# Altium schematic sheet [07]-PowerSupply.SchDoc: Powersupplies (part 3 of 4)
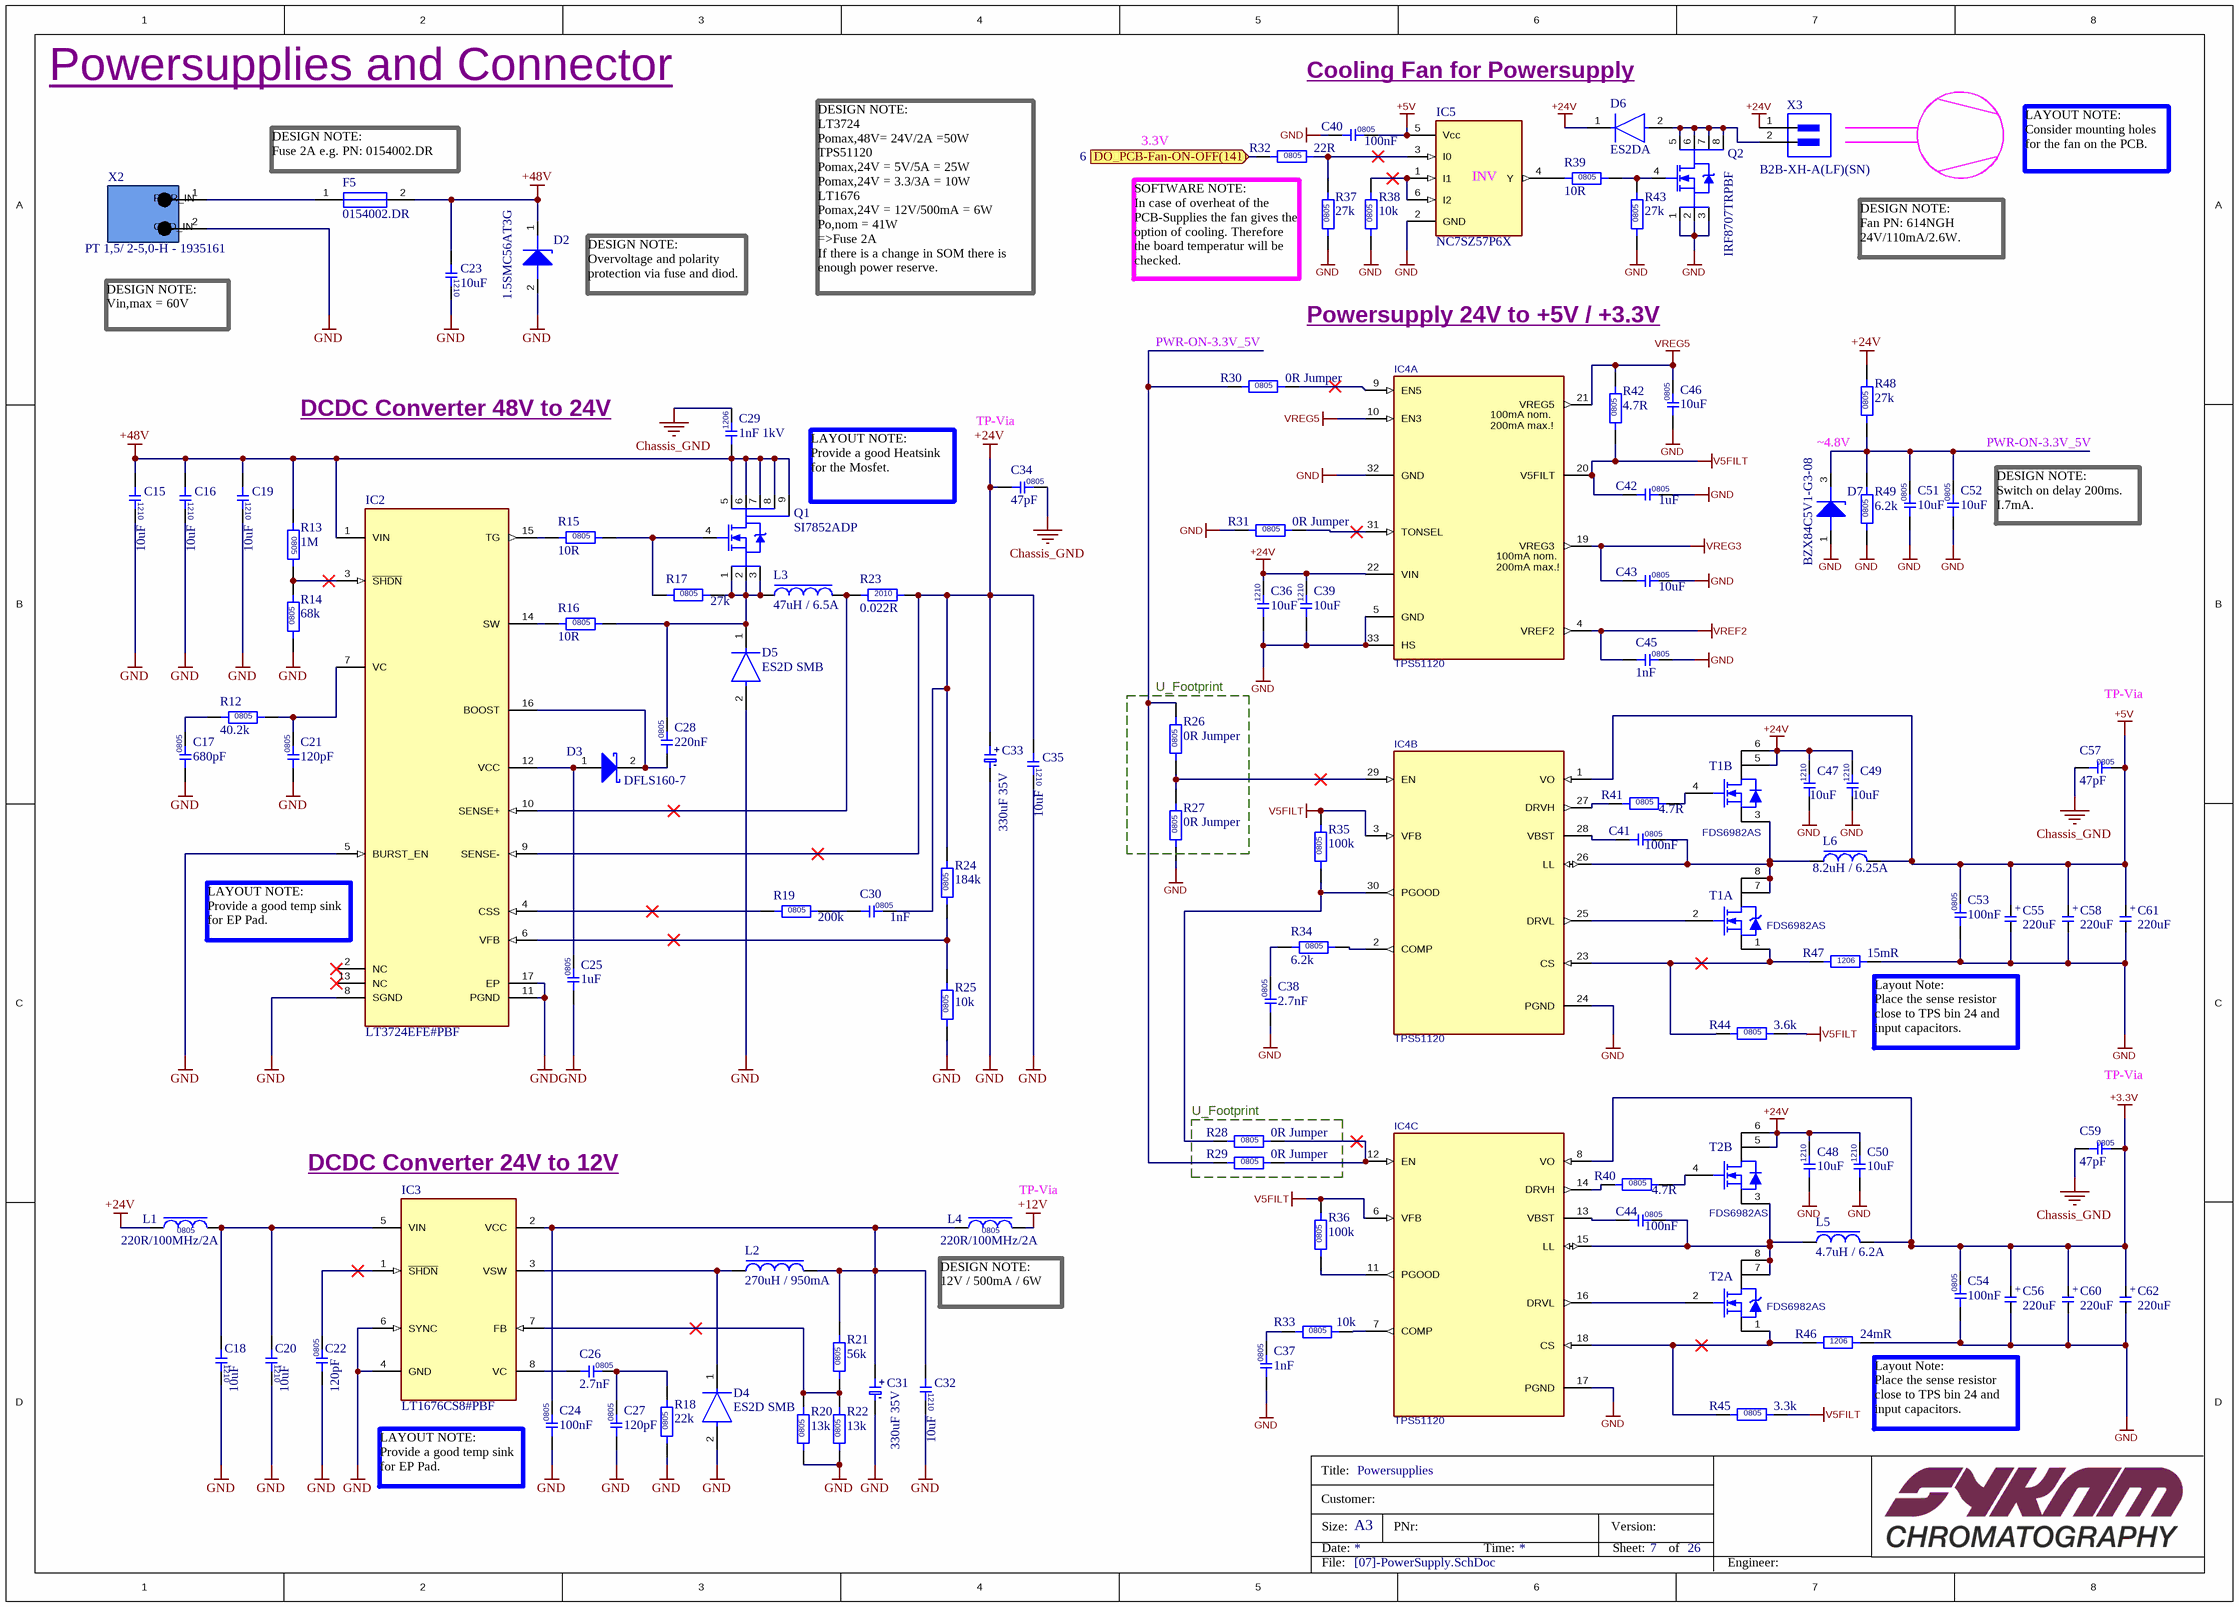
[diagram p2: [07]-PowerSupply.SchDoc]

## Library data of the parts (continued)
L1 L4 = L_BLM21PG221SN1D: Ferrite Beads Multi-Layer 220Ohm 25% 100MHz 2A 45mOhm DCR 0805 Paper T/R; Manufacturer: Murata; Material: Ferrite,Steel; Shielding: Unshielded; Number of Circuits: 1; DC Resistance (DCR): 45mR; Impedance: 220R; PCBChecked: initials after Checked; Supplier 1: Digi-Key; Manufacturer Part Number: BLM21PG221SN1D; RoHS: Yes; Category: Ferrite Beads and Chips; Case/Package: 0805; Number of Pins: 2; Case Code (Imperial): 0805; Core Material: Ferrite; Contact Plating: Tin,Matte; Case Code (Metric): 2012; Min Operating Temperature: -55°C; Max Operating Temperature: 125°C; Frequency: 100MHz; Number of Lines: 1; Max DC Current: 2A; Termination: SMD/SMT; Test Frequency: 100MHz; DC Current: 2A; Military Standard: Not; Current: 2A; Package Quantity: 1; Tolerance: 25%; Max Current Rating: 2A; Packaging: Tape and Reel; Current Rating: 2A; Length: 2mm; Height: 0.85mm; Depth: 1.25mm; Width: 1.25mm; Radiation Hardening: No; Lead Free: Lead Free; REACH SVHC: No SVHC; ComponentLink1URL: https://datasheet.ciiva.com/1012/l0110s0100blm21p-1012288.pdf?src-supplier=Digi-Key; ComponentLink1Description: https://datasheet.ciiva.com/1012/l0110s0100blm21p-1012288.pdf?src-supplier=Digi-Key; ComponentLink2URL: https://datasheet.ciiva.com/11799/0900766b81275e31-11799232.pdf?src-supplier=RSComponents; ComponentLink2Description: https://datasheet.ciiva.com/11799/0900766b81275e31-11799232.pdf?src-supplier=RSComponents; ComponentLink3URL: https://datasheet.ciiva.com/30514/1845321-30514028.pdf?src-supplier=Jameco; ComponentLink3Description: https://datasheet.ciiva.com/30514/1845321-30514028.pdf?src-supplier=Jameco; ComponentLink4URL: https://datasheet.ciiva.com/29348/442529-da-01-en-chip-drossel-0805-220r-2000ma-2-0x1-25mm-29348007.pdf?src-supplier=Conrad; ComponentLink4Description: https://datasheet.ciiva.com/29348/442529-da-01-en-chip-drossel-0805-220r-2000ma-2-0x1-25mm-29348007.pdf?src-supplier=Conrad; ComponentLink5URL: https://datasheet.ciiva.com/1012/l0110s0100blm21p-1012289.pdf?src-supplier=Digi-Key; ComponentLink5Description: https://datasheet.ciiva.com/1012/l0110s0100blm21p-1012289.pdf?src-supplier=Digi-Key; ComponentLink6URL: https://datasheet.ciiva.com/16215/l0110s0100blm21p-16215194.pdf?src-supplier=Future+Electronics; ComponentLink6Description: https://datasheet.ciiva.com/16215/l0110s0100blm21p-16215194.pdf?src-supplier=Future+Electronics; ComponentLink7URL: https://datasheet.ciiva.com/8021/1756152-8021598.pdf?src-supplier=Element14; ComponentLink7Description: https://datasheet.ciiva.com/8021/1756152-8021598.pdf?src-supplier=Element14; ComponentLink8URL: https://datasheet.ciiva.com/14122/anblm21p-data-e-14122214.pdf?src-supplier=Distrelec; ComponentLink8Description: https://datasheet.ciiva.com/14122/anblm21p-data-e-14122214.pdf?src-supplier=Distrelec; ComponentLink9URL: https://datasheet.ciiva.com/3081/l0110s0100blm21p-3081655.pdf?src-supplier=Avnet; ComponentLink9Description: https://datasheet.ciiva.com/3081/l0110s0100blm21p-3081655.pdf?src-supplier=Avnet; ComponentLink10URL: https://datasheet.ciiva.com/8021/1756152-8021596.pdf?src-supplier=Element14; ComponentLink10Description: https://datasheet.ciiva.com/8021/1756152-8021596.pdf?src-supplier=Element14; Supplier Part Number 1: 490-1054-6-ND; Stock 1: 868092; IPC7352C: done; SCHChecked: Initials after checked
L2 = L_270uH_SRR1208-271KL: Inductor Power Shielded Wirewound 270uH 10% 1KHz 13Q-Factor Ferrite 950mA 400mOhm DCR T/R; Manufacturer: Bourns; Saturation Current: 1.25A; DC Resistance (DCR): 400mR; Q Factor: 13; Self Resonant Frequency: 2MHz; Supplier 1: Farnell; Manufacturer Part Number: SRR1208-271KL; RoHS: Yes; Category: Fixed Inductors; Stock 1: 3; Pricing 1: 1=0,27700 (EUR); Mount: Surface Mount; Case/Package: 1208; Number of Pins: 2; Core Material: Ferrite; Min Operating Temperature: -40°C; Max Operating Temperature: 125°C; Package Quantity: 400; Current Rating: 950mA; Resistor Type: Wirewound; Inductance: 270uH; Test Frequency: 1kHz; Max DC Current: 950mA; Termination: SMD/SMT; RMS Current (Irms): 950mA; DC Current: 950mA; Inductance Tolerance: 10%; Tolerance: 10%; Packaging: Tape and Reel; Shielding: Shielded; Length: 0.5inch; Width: 0.5inch; Height: 8.5mm; Height - Seated (Max): 0.335inch; Depth: 13mm; REACH SVHC: No SVHC; Military Standard: Not; ComponentLink1URL: https://datasheet.ciiva.com/15025/srr1208-15025095.pdf?src-supplier=Digi-Key; ComponentLink1Description: https://datasheet.ciiva.com/15025/srr1208-15025095.pdf?src-supplier=Digi-Key; ComponentLink2URL: https://datasheet.ciiva.com/15025/srr1208-15025096.pdf?src-supplier=Digi-Key; ComponentLink2Description: https://datasheet.ciiva.com/15025/srr1208-15025096.pdf?src-supplier=Digi-Key; ComponentLink3URL: https://datasheet.ciiva.com/22717/1483756-22717964.pdf?src-supplier=Element14; ComponentLink3Description: https://datasheet.ciiva.com/22717/1483756-22717964.pdf?src-supplier=Element14; ComponentLink4URL: https://datasheet.ciiva.com/48684/srr1208-48684550.pdf?src-supplier=Avnet; ComponentLink4Description: https://datasheet.ciiva.com/48684/srr1208-48684550.pdf?src-supplier=Avnet; ComponentLink5URL: https://datasheet.ciiva.com/1072/srr1208-1072506.pdf?src-supplier=Digi-Key; ComponentLink5Description: https://datasheet.ciiva.com/1072/srr1208-1072506.pdf?src-supplier=Digi-Key; Supplier Part Number 1: 2333699
L3 = L_47uH_SRP1265A-470M: FIXED IND 47UH 6.5A 90 MOHM SMD; Manufacturer: Bourns; Core Material: Ferrite,Carbonyl Powder; Saturation Current: 9.5A; Shielding: Shielded; DC Resistance (DCR): 90mR; Self Resonant Frequency: 4MHz; Test Frequency: 100kHz; Tolerance: 20%; Q Factor: 20; Supplier 1: Farnell; Manufacturer Part Number: SRP1265A-470M; RoHS: Yes; Category: Fixed Inductors; Stock 1: 517; Pricing 1: 1=1,70000, 10=1,24000, 50=1,05000, 100=0,94300, 200=0,81000, 500=0,79900, 2500=0,76500 (EUR); Mount: Surface Mount; Case/Package: Nonstandard; Min Operating Temperature: -40°C; Max Operating Temperature: 150°C; Resistor Type: Wirewound; Inductance: 47uH; Current Rating: 6.5A; RMS Current (Irms): 6.5A; Max DC Current: 6.5A; Termination: SMD/SMT; Packaging: Tape and Reel; Inductance Tolerance: 20%; Package Quantity: 500; Length: 13.5mm; Width: 12.5mm; Height: 6.2mm; Height - Seated (Max): 0.252inch; Depth: 12.5mm; Ratings: AEC-Q200; REACH SVHC: No SVHC; ComponentLink1URL: https://datasheet.ciiva.com/48684/srp1265a-48684885.pdf?src-supplier=Avnet; ComponentLink1Description: https://datasheet.ciiva.com/48684/srp1265a-48684885.pdf?src-supplier=Avnet; ComponentLink2URL: https://datasheet.ciiva.com/46437/1828825-46437462.pdf?src-supplier=Element14; ComponentLink2Description: https://datasheet.ciiva.com/46437/1828825-46437462.pdf?src-supplier=Element14; Supplier Part Number 1: 2434080
L5 = L_7447797470: WURTH ELEKTRONIK - 7447797470 - Power Inductor (SMD), 4.7 µH, 6.2 A, Shielded, 8 A, WE-PDF Series, 10.2mm x 10.2mm x 4.5mm - Power Inductor (SMD), 4.7 µH, 6.2 A, Shielded, 8 A, WE-PDF Series, 10.2mm x 10.2mm x 4.5mm; Manufacturer: Wurth Electronics; Core Material: Metal,Composite,Ferrite; Tolerance: 20%; Self Resonant Frequency: 45MHz; Saturation Current: 8A; DC Resistance (DCR): 19.5mR; Test Frequency: 100kHz; Max DC Current: 5.8A; Supplier 1: Farnell; Manufacturer Part Number: 7447797470; RoHS: Yes; Category: Fixed Inductors; Stock 1: 245; Pricing 1: 1=3,18000, 5=2,76000, 10=2,33000, 20=2,29000, 40=2,25000, 100=1,93000, 500=1,69000 (EUR); Mount: Surface Mount; Case/Package: Nonstandard; Min Operating Temperature: -40°C; Max Operating Temperature: 150°C; Inductance: 4.7uH; Inductance Tolerance: 20%; Package Quantity: 500; Current Rating: 6.2A; Shielding: Shielded; Packaging: Cut Tape; Resistor Type: Wirewound; RMS Current (Irms): 6.2A; Length: 0.402inch; Height: 4.5mm; Width: 0.402inch; Height - Seated (Max): 0.177inch; Depth: 10.2mm; REACH SVHC: Unknown; Lead Free: Lead Free; ComponentLink1URL: https://datasheet.ciiva.com/11803/0900766b80d8967e-11803072.pdf?src-supplier=RSComponents; ComponentLink1Description: https://datasheet.ciiva.com/11803/0900766b80d8967e-11803072.pdf?src-supplier=RSComponents; ComponentLink2URL: https://datasheet.ciiva.com/1059/7447797470-1059286.pdf?src-supplier=Digi-Key; ComponentLink2Description: https://datasheet.ciiva.com/1059/7447797470-1059286.pdf?src-supplier=Digi-Key; ComponentLink3URL: https://datasheet.ciiva.com/5975/530533-5975593.pdf?src-supplier=Farnell; ComponentLink3Description: https://datasheet.ciiva.com/5975/530533-5975593.pdf?src-supplier=Farnell; ComponentLink4URL: https://datasheet.ciiva.com/1059/7447797470-1059287.pdf?src-supplier=Digi-Key; ComponentLink4Description: https://datasheet.ciiva.com/1059/7447797470-1059287.pdf?src-supplier=Digi-Key; ComponentLink5URL: https://datasheet.ciiva.com/1059/7447797470-1059288.pdf?src-supplier=Digi-Key; ComponentLink5Description: https://datasheet.ciiva.com/1059/7447797470-1059288.pdf?src-supplier=Digi-Key; Supplier Part Number 1: 1800270
L6 = L_744771008: Inductor, SMD 8.2 uH 6.25 A ±20%, 744771008, Würth Elektronik; Manufacturer: Wurth Electronics; Core Material: Ferrite; Shielding: Shielded; Self Resonant Frequency: 25MHz; Resistance: 20mR; Test Frequency: 1kHz; Supplier 1: Farnell; Manufacturer Part Number: 744771008; RoHS: Yes; Category: Fixed Inductors; Stock 1: 675; Pricing 1: 1=2,49000, 5=2,20000, 10=1,90000, 20=1,73000, 40=1,55000, 100=1,27000, 500=1,10000 (EUR); Mount: Surface Mount; Case/Package: Nonstandard; Weight: 0.01lb; Min Operating Temperature: -40°C; Max Operating Temperature: 125°C; Package Quantity: 500; Current Rating: 6.25A; Saturation Current: 6.25A; Tolerance: 20%; Packaging: Tape and Reel; Inductance Tolerance: 20%; Inductance: 8.2uH; Resistor Type: Wirewound; DC Resistance (DCR): 20mR; Max DC Current: 6.25A; Termination: SMD/SMT; RMS Current (Irms): 6.25A; Series Resistance: 20mR; Length: 12mm; Height: 6mm; Width: 12mm; Height - Seated (Max): 0.236inch; Depth: 12mm; REACH SVHC: Unknown; Lead Free: Lead Free; ComponentLink1URL: https://datasheet.ciiva.com/1052/744771008-1052275.pdf?src-supplier=Digi-Key; ComponentLink1Description: https://datasheet.ciiva.com/1052/744771008-1052275.pdf?src-supplier=Digi-Key; ComponentLink2URL: https://datasheet.ciiva.com/4954/744771008-28897-4954803.pdf?src-supplier=Mouser; ComponentLink2Description: https://datasheet.ciiva.com/4954/744771008-28897-4954803.pdf?src-supplier=Mouser; ComponentLink3URL: https://datasheet.ciiva.com/30489/0900766b81281ba3-30489743.pdf?src-supplier=RSComponents; ComponentLink3Description: https://datasheet.ciiva.com/30489/0900766b81281ba3-30489743.pdf?src-supplier=RSComponents; ComponentLink4URL: https://datasheet.ciiva.com/1052/744771008-1052276.pdf?src-supplier=Digi-Key; ComponentLink4Description: https://datasheet.ciiva.com/1052/744771008-1052276.pdf?src-supplier=Digi-Key; ComponentLink5URL: https://datasheet.ciiva.com/1052/744771008-1052277.pdf?src-supplier=Digi-Key; ComponentLink5Description: https://datasheet.ciiva.com/1052/744771008-1052277.pdf?src-supplier=Digi-Key; ComponentLink6URL: https://datasheet.ciiva.com/26307/744771008-eng-tds-26307964.pdf?src-supplier=Distrelec; ComponentLink6Description: https://datasheet.ciiva.com/26307/744771008-eng-tds-26307964.pdf?src-supplier=Distrelec; Supplier Part Number 1: 1635905
Q1 = Q_NMOS_SI7852ADP-T1-GE3: MOSFET N-CH 80V 30A PPAK SO-8; Manufacturer: Vishay Siliconix; Rise Time: 9ns; Rds On Max: 17mR; Input Capacitance: 1.825nF; Continuous Drain Current (ID): 12A; Max Power Dissipation: 62.5W; Gate to Source Voltage (Vgs): 20V; Turn-Off Delay Time: 26ns; Turn-On Delay Time: 16ns; Element Configuration: Single; Number of Channels: 1; Polarity: N-CHANNEL; Threshold Voltage: 4.5V; Power Dissipation: 5W; Supplier 1: Mouser; Manufacturer Part Number: SI7852ADP-T1-GE3; RoHS: Yes; Category: MOSFETs; Stock 1: 3670; Mount: Surface Mount; Case/Package: SOIC; Number of Pins: 8; Weight: 0.01787oz; Min Operating Temperature: -55°C; Max Operating Temperature: 150°C; Packaging: Tape and Reel; Package Quantity: 1; Drain to Source Voltage (Vdss): 80V; Drain to Source Resistance: 17mR; Fall Time: 9ns; Drain to Source Breakdown Voltage: 80V; Number of Elements: 1; On-State Resistance: 17MR; Series: TrenchFET®; Drain-source On Resistance-Max: 17MR; Length: 4.9mm; Width: 5.89mm; Height: 1.04mm; Radiation Hardening: No; RoHS Compliant: Yes; REACH SVHC: Unknown; Lead Free: Lead Free; ComponentLink1URL: https://datasheet.ciiva.com/6386/si7852ad-6386432.pdf?src-supplier=Digi-Key; ComponentLink1Description: https://datasheet.ciiva.com/6386/si7852ad-6386432.pdf?src-supplier=Digi-Key; ComponentLink2URL: https://datasheet.ciiva.com/26791/si7852adp-t1-ge3-26791882.pdf?src-supplier=IIIC; ComponentLink2Description: https://datasheet.ciiva.com/26791/si7852adp-t1-ge3-26791882.pdf?src-supplier=IIIC; ComponentLink3URL: https://datasheet.ciiva.com/16486/si7852ad-16486555.pdf?src-supplier=Future+Electronics; ComponentLink3Description: https://datasheet.ciiva.com/16486/si7852ad-16486555.pdf?src-supplier=Future+Electronics; ComponentLink4URL: https://datasheet.ciiva.com/6386/si7852ad-6386428.pdf?src-supplier=Digi-Key; ComponentLink4Description: https://datasheet.ciiva.com/6386/si7852ad-6386428.pdf?src-supplier=Digi-Key; ComponentLink5URL: https://datasheet.ciiva.com/6386/si7852ad-6386431.pdf?src-supplier=Digi-Key; ComponentLink5Description: https://datasheet.ciiva.com/6386/si7852ad-6386431.pdf?src-supplier=Digi-Key; Supplier Part Number 1: 781-SI7852ADP-T1-GE3
Q2 = Q_IRF8707TRPBF: MOSFET N-CH 30V 11A 8-SOIC; Manufacturer: International Rectifier; Gate to Source Voltage (Vgs): 20V; Turn-On Delay Time: 6.7ns; Turn-Off Delay Time: 7.3ns; Fall Time: 4.4ns; Rise Time: 7.9ns; On-State Resistance: 11.9MR; Max Power Dissipation: 2.5W; Drain to Source Resistance: 17.5mR; Threshold Voltage: 1.8V; Number of Elements: 1; Input Capacitance: 760pF; Supplier 1: Farnell; Manufacturer Part Number: IRF8707TRPBF; RoHS: Yes; Category: MOSFETs; Stock 1: 1365; Pricing 1: 5=0,48600, 10=0,36900, 100=0,21900, 250=0,20900, 500=0,19800, 1000=0,16000, 5000=0,15700 (EUR); Mount: Surface Mount; Case/Package: SOIC; Number of Pins: 8; Min Operating Temperature: -55°C; Max Operating Temperature: 150°C; Drain to Source Voltage (Vdss): 30V; Continuous Drain Current (ID): 11A; Drain to Source Breakdown Voltage: 30V; Power Dissipation: 2.5W; Packaging: Tape and Reel; Package Quantity: 1; Rds On Max: 11.9mR; Nominal Vgs: 1.8V; Length: 5mm; Height: 1.5mm; Width: 4mm; Radiation Hardening: No; Lead Free: Lead Free; REACH SVHC: No SVHC; ComponentLink1URL: https://datasheet.ciiva.com/6382/irf8707pbf-6382832.pdf?src-supplier=Digi-Key; ComponentLink1Description: https://datasheet.ciiva.com/6382/irf8707pbf-6382832.pdf?src-supplier=Digi-Key; ComponentLink2URL: https://datasheet.ciiva.com/26790/irf8707trpbf-26790830.pdf?src-supplier=IIIC; ComponentLink2Description: https://datasheet.ciiva.com/26790/irf8707trpbf-26790830.pdf?src-supplier=IIIC; ComponentLink3URL: https://datasheet.ciiva.com/7870/28224-7870519.pdf?src-supplier=Element14; ComponentLink3Description: https://datasheet.ciiva.com/7870/28224-7870519.pdf?src-supplier=Element14; ComponentLink4URL: https://datasheet.ciiva.com/8116/irf8707pbf-8116344.pdf?src-supplier=Avnet; ComponentLink4Description: https://datasheet.ciiva.com/8116/irf8707pbf-8116344.pdf?src-supplier=Avnet; ComponentLink5URL: https://datasheet.ciiva.com/16369/irf8707pbf-16369518.pdf?src-supplier=Future+Electronics; ComponentLink5Description: https://datasheet.ciiva.com/16369/irf8707pbf-16369518.pdf?src-supplier=Future+Electronics; ComponentLink6URL: https://datasheet.ciiva.com/6382/irf8707pbf-6382827.pdf?src-supplier=Digi-Key; ComponentLink6Description: https://datasheet.ciiva.com/6382/irf8707pbf-6382827.pdf?src-supplier=Digi-Key; ComponentLink7URL: https://datasheet.ciiva.com/6382/irf8707pbf-6382830.pdf?src-supplier=Digi-Key; ComponentLink7Description: https://datasheet.ciiva.com/6382/irf8707pbf-6382830.pdf?src-supplier=Digi-Key; Supplier Part Number 1: 2725922
R12 = R_40.2k_CR0805-FX-4022ELF: Resistor,Ruthenium Oxide,40.2KOhms,100WV,1+/-% Tol,-100,100ppm-TC,0805-Case ;RoHS Compliant: Yes; Manufacturer: Bourns; Resistance: 40.2kR; Tolerance: 1%; Temperature Coefficient: 100ppm/°C; Power Rating: 125mW; Voltage Rating: 150V; Supplier 1: Mouser; Manufacturer Part Number: CR0805-FX-4022ELF; RoHS: Yes; Category: Chip SMD Resistors; Stock 1: 40102; Mount: Surface Mount; Case/Package: 0805; Contact Plating: Tin; Case Code (Imperial): 0805; Case Code (Metric): 2012; Min Operating Temperature: -55°C; Max Operating Temperature: 155°C; Resistor Type: Thick Film; Packaging: Tape and Reel; Package Quantity: 5000; Termination: SMD/SMT; Number of Terminations: 2; Max Power Dissipation: 125mW; Features: Moisture Resistant; Length: 2mm; Width: 1.25mm; Height: 0.024inch; Depth: 1.25mm; Thickness: 508um; Radiation Hardening: No; Military Standard: Not; ComponentLink1URL: https://datasheet.ciiva.com/9121/chpreztr-9121414.pdf?src-supplier=Avnet; ComponentLink1Description: https://datasheet.ciiva.com/9121/chpreztr-9121414.pdf?src-supplier=Avnet; ComponentLink2URL: https://datasheet.ciiva.com/14985/chpreztr-14985769.pdf?src-supplier=Digi-Key; ComponentLink2Description: https://datasheet.ciiva.com/14985/chpreztr-14985769.pdf?src-supplier=Digi-Key; Supplier Part Number 1: 652-CR0805FX-4022ELF
R13 = R_1M_RC0805FR-071ML: Res Thick Film 0805 1M Ohm 1% 0.125W(1/8W) ±100ppm/C Epoxy SMD T/R; Manufacturer: Yageo; Temperature Coefficient: 100ppm/°C; Resistance: 1MR; Power Rating: 125mW; Voltage Rating: 150V; Manufacturer Part Number: RC0805FR-071ML; RoHS: Yes; Category: Chip SMD Resistors; Case/Package: 0805; Case Code (Metric): 2012; Case Code (Imperial): 0805; Min Operating Temperature: -55°C; Max Operating Temperature: 155°C; Composition: Thick Film; Tolerance: 1%; Packaging: Tape and Reel; Number of Terminations: 2; Termination: SMD/SMT; Military Standard: Not; Max Power Dissipation: 125mW; Features: Moisture Resistant; Package Quantity: 1; Length: 0.079inch; Height: 0.024inch; Width: 0.049inch; Depth: 1.25mm; REACH SVHC: Unknown; Lead Free: Lead Free; ComponentLink1URL: https://datasheet.ciiva.com/2519/pyu-r-int-thick-7-2519712.pdf?src-supplier=Digi-Key; ComponentLink1Description: https://datasheet.ciiva.com/2519/pyu-r-int-thick-7-2519712.pdf?src-supplier=Digi-Key; ComponentLink2URL: https://datasheet.ciiva.com/12666/rc0805-12666975.pdf?src-supplier=Mouser; ComponentLink2Description: https://datasheet.ciiva.com/12666/rc0805-12666975.pdf?src-supplier=Mouser; ComponentLink3URL: https://datasheet.ciiva.com/2519/pyu-r-int-thick-7-2519713.pdf?src-supplier=Digi-Key; ComponentLink3Description: https://datasheet.ciiva.com/2519/pyu-r-int-thick-7-2519713.pdf?src-supplier=Digi-Key; ComponentLink4URL: https://datasheet.ciiva.com/2519/pyu-r-int-thick-7-2519711.pdf?src-supplier=Digi-Key; ComponentLink4Description: https://datasheet.ciiva.com/2519/pyu-r-int-thick-7-2519711.pdf?src-supplier=Digi-Key; ComponentLink5URL: https://datasheet.ciiva.com/17419/rc0805-17419909.pdf?src-supplier=Future+Electronics; ComponentLink5Description: https://datasheet.ciiva.com/17419/rc0805-17419909.pdf?src-supplier=Future+Electronics; Stock 2: 3286221; Pricing 2: 1=0,10000, 10=0,04000, 100=0,01630, 1000=0,00731, 2500=0,00635 (USD); Mount: Surface Mount; Number of Pins: 2; Voltage Rating (DC): 150V; ComponentLink6URL: http://www.farnell.com/datasheets/2167052.pdf?src-supplier=Farnell; ComponentLink6Description: http://www.farnell.com/datasheets/2167052.pdf?src-supplier=Farnell; ComponentLink7URL: http://www.mouser.com/ds/2/447/Yageo_08112016_RC0805-968729.pdf?src-supplier=Mouser; ComponentLink7Description: http://www.mouser.com/ds/2/447/Yageo_08112016_RC0805-968729.pdf?src-supplier=Mouser; ComponentLink8URL: http://www.farnell.com/datasheets/444164.pdf?src-supplier=Element14; ComponentLink8Description: http://www.farnell.com/datasheets/444164.pdf?src-supplier=Element14; ComponentLink9URL: http://www.farnell.com/datasheets/2167052.pdf?src-supplier=Newark; ComponentLink9Description: http://www.farnell.com/datasheets/2167052.pdf?src-supplier=Newark; ComponentLink10URL: http://www.yageo.com/documents/recent/PYu-RC_Group_51_RoHS_L_10.pdf?src-supplier=Digi-Key; ComponentLink10Description: http://www.yageo.com/documents/recent/PYu-RC_Group_51_RoHS_L_10.pdf?src-supplier=Digi-Key; Supplier 1: Digi-Key; Supplier Part Number 1: 311-1.00MCRCT-ND
R14 = R_68k_CRCW080568K0FKEA: VISHAY - CRCW080568K0FKEA - SMD Chip Resistor, 0805 [2012 Metric], 68 kohm, CRCW e3 Series, 150 V, Thick Film, 125 mW; Resistance: 68kR; Tolerance: 1%; Temperature Coefficient: 100ppm/°C; Power Rating: 125mW; Voltage Rating: 150V; Supplier 1: Farnell; Manufacturer: Vishay; Manufacturer Part Number: CRCW080568K0FKEA; RoHS: Yes; Category: Chip SMD Resistors; Stock 1: 12029; Pricing 1: 10=0,06040, 100=0,02760, 500=0,01940, 1000=0,01110, 2500=0,01050 (EUR); Case/Package: 0805; Number of Pins: 2; Case Code (Imperial): 0805; Case Code (Metric): 2012; Contact Plating: Tin; Weight: 0.000194oz; Size Code: 0805; Min Operating Temperature: -55°C; Max Operating Temperature: 155°C; Packaging: Tape and Reel; Resistor Type: Thick Film; Termination: SMD/SMT; Series: CRCW; Package Quantity: 10; Max Power Dissipation: 125mW; Number of Terminations: 2; Voltage Rating (DC): 150V; Features: Automotive AEC-Q200; Construction: Rectangular; Resistance Tolerance: 1%; Technology: THICK FILM; Length: 2mm; Width: 1.25mm; Height: 0.45mm; Depth: 1.25mm; Radiation Hardening: No; RoHS Compliant: Yes; Lead Free: Lead Free; Military Standard: Not; REACH SVHC: Unknown; ComponentLink1URL: https://datasheet.ciiva.com/11809/0900766b80d98b26-11809168.pdf?src-supplier=RSComponents; ComponentLink1Description: https://datasheet.ciiva.com/11809/0900766b80d98b26-11809168.pdf?src-supplier=RSComponents; ComponentLink2URL: https://datasheet.ciiva.com/2495/dcrcwe3-2495650.pdf?src-supplier=Digi-Key; ComponentLink2Description: https://datasheet.ciiva.com/2495/dcrcwe3-2495650.pdf?src-supplier=Digi-Key; ComponentLink3URL: https://datasheet.ciiva.com/2495/dcrcwe3-2495651.pdf?src-supplier=Digi-Key; ComponentLink3Description: https://datasheet.ciiva.com/2495/dcrcwe3-2495651.pdf?src-supplier=Digi-Key; ComponentLink4URL: https://datasheet.ciiva.com/2495/dcrcwe3-2495652.pdf?src-supplier=Digi-Key; ComponentLink4Description: https://datasheet.ciiva.com/2495/dcrcwe3-2495652.pdf?src-supplier=Digi-Key; ComponentLink5URL: https://datasheet.ciiva.com/7673/1697337-7673014.pdf?src-supplier=Element14; ComponentLink5Description: https://datasheet.ciiva.com/7673/1697337-7673014.pdf?src-supplier=Element14; ComponentLink6URL: https://datasheet.ciiva.com/17175/dcrcwe3-17175158.pdf?src-supplier=Avnet+Europe; ComponentLink6Description: https://datasheet.ciiva.com/17175/dcrcwe3-17175158.pdf?src-supplier=Avnet+Europe; ComponentLink7URL: https://datasheet.ciiva.com/16759/70201119-16759687.pdf?src-supplier=Allied+Electronics; ComponentLink7Description: https://datasheet.ciiva.com/16759/70201119-16759687.pdf?src-supplier=Allied+Electronics; ComponentLink8URL: https://datasheet.ciiva.com/7673/1697337-7673160.pdf?src-supplier=Element14; ComponentLink8Description: https://datasheet.ciiva.com/7673/1697337-7673160.pdf?src-supplier=Element14; ComponentLink9URL: https://datasheet.ciiva.com/8897/dcrcwe3-8897081.pdf?src-supplier=Avnet; ComponentLink9Description: https://datasheet.ciiva.com/8897/dcrcwe3-8897081.pdf?src-supplier=Avnet; ComponentLink10URL: https://datasheet.ciiva.com/26314/fld-crcw-e3-data-en-26314588.pdf?src-supplier=Distrelec; ComponentLink10Description: https://datasheet.ciiva.com/26314/fld-crcw-e3-data-en-26314588.pdf?src-supplier=Distrelec; Supplier Part Number 1: 1469953
R15 R16 R39 = R_10R_RC0805FR-0710RL: YAGEO (PHYCOMP) - RC0805FR-0710RL - RES, THICK FILM, 10R, 1%, 0.125W, 0805; Power Rating: 125mW; Voltage Rating: 150V; Temperature Coefficient: 200ppm/°C; PCBChecked: initials after Checked; Supplier 1: Digi-Key; Manufacturer Part Number: RC0805FR-0710RL; RoHS: Yes; Category: Chip SMD Resistors; Case/Package: 0805; Number of Pins: 2; Case Code (Imperial): 0805; Case Code (Metric): 2012; Min Operating Temperature: -55°C; Max Operating Temperature: 155°C; Resistance: 10R; Tolerance: 1%; Packaging: Tape and Reel; Voltage Rating (DC): 150V; Package Quantity: 1; Features: Moisture Resistant; Termination: SMD/SMT; Composition: Thick Film; Number of Terminations: 2; Max Power Dissipation: 125mW; Length: 2mm; Height: 0.5mm; Width: 1.25mm; Depth: 1.25mm; Lead Free: Lead Free; REACH SVHC: No SVHC; ComponentLink1URL: https://datasheet.ciiva.com/11809/0900766b8106beab-11809370.pdf?src-supplier=RSComponents; ComponentLink1Description: https://datasheet.ciiva.com/11809/0900766b8106beab-11809370.pdf?src-supplier=RSComponents; ComponentLink2URL: https://datasheet.ciiva.com/7941/444164-7941687.pdf?src-supplier=Element14; ComponentLink2Description: https://datasheet.ciiva.com/7941/444164-7941687.pdf?src-supplier=Element14; ComponentLink3URL: https://datasheet.ciiva.com/7941/444164-7941688.pdf?src-supplier=Element14; ComponentLink3Description: https://datasheet.ciiva.com/7941/444164-7941688.pdf?src-supplier=Element14; ComponentLink4URL: https://datasheet.ciiva.com/12555/rc0805-257173-12555112.pdf?src-supplier=Mouser; ComponentLink4Description: https://datasheet.ciiva.com/12555/rc0805-257173-12555112.pdf?src-supplier=Mouser; ComponentLink5URL: https://datasheet.ciiva.com/2457/pyu-r-int-thick-7-2457098.pdf?src-supplier=Digi-Key; ComponentLink5Description: https://datasheet.ciiva.com/2457/pyu-r-int-thick-7-2457098.pdf?src-supplier=Digi-Key; ComponentLink6URL: https://datasheet.ciiva.com/2457/pyu-r-int-thick-7-2457099.pdf?src-supplier=Digi-Key; ComponentLink6Description: https://datasheet.ciiva.com/2457/pyu-r-int-thick-7-2457099.pdf?src-supplier=Digi-Key; ComponentLink7URL: https://datasheet.ciiva.com/46412/444164-46412859.pdf?src-supplier=Element14; ComponentLink7Description: https://datasheet.ciiva.com/46412/444164-46412859.pdf?src-supplier=Element14; ComponentLink8URL: https://datasheet.ciiva.com/2457/pyu-r-int-thick-7-2457100.pdf?src-supplier=Digi-Key; ComponentLink8Description: https://datasheet.ciiva.com/2457/pyu-r-int-thick-7-2457100.pdf?src-supplier=Digi-Key; ComponentLink9URL: https://datasheet.ciiva.com/46447/444164-46447565.pdf?src-supplier=Element14; ComponentLink9Description: https://datasheet.ciiva.com/46447/444164-46447565.pdf?src-supplier=Element14; Supplier Part Number 1: 311-10.0CRCT-ND; Manufacturer: Yageo; Stock 1: 2009396; IPC7352C: done; SCHChecked: Initials after checked
R17 R37 R43 R48 = R_27k_RC0805FR-0727KL: Surface Mount Thick Film Resistor, RC Series, 27 kohm, 125 mW, - 1%, 150 V, 0805 [2012 Metric]; Manufacturer: Yageo; Resistance: 27kR; Temperature Coefficient: 100ppm/°C; Power Rating: 125mW; Voltage Rating: 150V; Supplier 1: Digi-Key; Manufacturer Part Number: RC0805FR-0727KL; RoHS: Yes; Category: Chip SMD Resistors; Stock 1: 307907; Pricing 1: 1=0,10000, 10=0,04000, 100=0,01630, 1000=0,00731, 2500=0,00635 (USD); Case/Package: 0805; Case Code (Metric): 2012; Case Code (Imperial): 0805; Min Operating Temperature: -55°C; Max Operating Temperature: 155°C; Tolerance: 1%; Composition: Thick Film; Packaging: Tape and Reel; Package Quantity: 1; Number of Terminations: 2; Termination: SMD/SMT; Military Standard: Not; Max Power Dissipation: 125mW; Features: Moisture Resistant; Length: 2mm; Height: 0.5mm; Width: 0.049inch; Depth: 1.25mm; Lead Free: Lead Free; REACH SVHC: Unknown; ComponentLink1URL: https://datasheet.ciiva.com/11809/0900766b8106beab-11809381.pdf?src-supplier=RSComponents; ComponentLink1Description: https://datasheet.ciiva.com/11809/0900766b8106beab-11809381.pdf?src-supplier=RSComponents; ComponentLink2URL: https://datasheet.ciiva.com/2457/pyu-r-int-thick-7-2457986.pdf?src-supplier=Digi-Key; ComponentLink2Description: https://datasheet.ciiva.com/2457/pyu-r-int-thick-7-2457986.pdf?src-supplier=Digi-Key; ComponentLink3URL: https://datasheet.ciiva.com/2457/pyu-r-int-thick-7-2457988.pdf?src-supplier=Digi-Key; ComponentLink3Description: https://datasheet.ciiva.com/2457/pyu-r-int-thick-7-2457988.pdf?src-supplier=Digi-Key; ComponentLink4URL: https://datasheet.ciiva.com/7941/444164-7941751.pdf?src-supplier=Element14; ComponentLink4Description: https://datasheet.ciiva.com/7941/444164-7941751.pdf?src-supplier=Element14; ComponentLink5URL: https://datasheet.ciiva.com/2457/pyu-r-int-thick-7-2457987.pdf?src-supplier=Digi-Key; ComponentLink5Description: https://datasheet.ciiva.com/2457/pyu-r-int-thick-7-2457987.pdf?src-supplier=Digi-Key; ComponentLink6URL: https://datasheet.ciiva.com/7941/444164-7941750.pdf?src-supplier=Element14; ComponentLink6Description: https://datasheet.ciiva.com/7941/444164-7941750.pdf?src-supplier=Element14; Supplier Part Number 1: 311-27.0KCRCT-ND
R18 = R_22k_WCR0805-22KFI: TT ELECTRONICS / WELWYN - WCR0805-22KFI - RES, 22K, 1%, 0.125W, 0805, THICK FILM; Manufacturer: TT Welwyn; Resistance: 22kR; Power Rating: 125mW; Voltage Rating: 150V; Temperature Coefficient: 100ppm/°C; Insulation Resistance: 1GR; Supplier 1: Farnell; Manufacturer Part Number: WCR0805-22KFI; RoHS: Yes; Category: Chip SMD Resistors; Stock 1: 52160; Pricing 1: 10=0,02340, 100=0,01820, 500=0,01120, 1000=0,00990, 2500=0,00870 (EUR); Case/Package: 0805; Number of Pins: 2; Case Code (Metric): 2012; Case Code (Imperial): 0805; Min Operating Temperature: -55°C; Max Operating Temperature: 155°C; Packaging: Tape and Reel; Tolerance: 1%; Voltage Rating (DC): 150V; Resistor Type: Thick Film; Length: 2mm; Width: 1.25mm; Depth: 1.25mm; REACH SVHC: No SVHC; Military Standard: Not; ComponentLink1URL: https://datasheet.ciiva.com/7879/1851687-7879973.pdf?src-supplier=Element14; ComponentLink1Description: https://datasheet.ciiva.com/7879/1851687-7879973.pdf?src-supplier=Element14; Supplier Part Number 1: 1099809
R19 = R_200k_RC0805FR-07200KL: YAGEO - RC0805FR-07200KL - RES, THICK FILM, 200K, 1%, 0.125W, 0805, REEL; Resistance: 200kR; Temperature Coefficient: 100ppm/°C; Power Rating: 125mW; Voltage Rating: 150V; Supplier 1: Farnell; Manufacturer: Yageo; Manufacturer Part Number: RC0805FR-07200KL; RoHS: Yes; Category: Chip SMD Resistors; Stock 1: 10000; Pricing 1: 5000=0,00830 (EUR); Case/Package: 0805; Number of Pins: 2; Contact Plating: Tin,Matte; Case Code (Imperial): 0805; Case Code (Metric): 2012; Min Operating Temperature: -55°C; Max Operating Temperature: 155°C; Tolerance: 1%; Composition: Thick Film; Packaging: Tape and Reel; Termination: SMD/SMT; Military Standard: Not; Working Voltage: 150V; Number of Terminations: 2; Voltage Rating (DC): 150V; Length: 2mm; Height: 0.5mm; Depth: 1.25mm; Radiation Hardening: No; REACH SVHC: No SVHC; Lead Free: Lead Free; ComponentLink1URL: https://datasheet.ciiva.com/11808/0900766b8106beab-11808861.pdf?src-supplier=RSComponents; ComponentLink1Description: https://datasheet.ciiva.com/11808/0900766b8106beab-11808861.pdf?src-supplier=RSComponents; ComponentLink2URL: https://datasheet.ciiva.com/15189/getdatasheetpartid-71710-15189925.pdf?src-supplier=Verical; ComponentLink2Description: https://datasheet.ciiva.com/15189/getdatasheetpartid-71710-15189925.pdf?src-supplier=Verical; ComponentLink3URL: https://datasheet.ciiva.com/46395/444164-46395126.pdf?src-supplier=Element14; ComponentLink3Description: https://datasheet.ciiva.com/46395/444164-46395126.pdf?src-supplier=Element14; ComponentLink4URL: https://datasheet.ciiva.com/12668/rc0805-12668200.pdf?src-supplier=Mouser; ComponentLink4Description: https://datasheet.ciiva.com/12668/rc0805-12668200.pdf?src-supplier=Mouser; Supplier Part Number 1: 2413771
R20 R22 = R_13k_RC0805FR-0713KL: Res Thick Film 2.0 x 1.2 mm 13K Ohm 1% 0.125W(1/8W) 100ppm/ C Molded SMD Paper T/R; Manufacturer: Yageo; Resistance: 13kR; Temperature Coefficient: 100ppm/°C; Voltage Rating (DC): 150V; Power Rating: 125mW; Supplier 1: Mouser; Manufacturer Part Number: RC0805FR-0713KL; RoHS: Yes; Category: Chip SMD Resistors; Stock 1: 23655; Pricing 1: 1=0,11000, 10=0,02600, 100=0,00900, 1000=0,00700, 5000=0,00400, 1=0,13000, 10=0,03100, 100=0,01100, 1000=0,00800, 5000=0,00500, 10000=0,00500 (EUR); Mount: Surface Mount; Case/Package: 0805; Case Code (Metric): 2012; Case Code (Imperial): 0805; Min Operating Temperature: -55°C; Max Operating Temperature: 155°C; Tolerance: 1%; Composition: Thick Film; Packaging: Tape and Reel; Package Quantity: 1; Voltage Rating: 150V; Number of Terminations: 2; Termination: SMD/SMT; Military Standard: Not; Max Power Dissipation: 125mW; Features: Moisture Resistant; Length: 2mm; Height: 0.5mm; Width: 0.049inch; Depth: 1.25mm; Lead Free: Lead Free; ComponentLink1URL: https://datasheet.ciiva.com/11808/0900766b8106beab-11808595.pdf?src-supplier=RSComponents; ComponentLink1Description: https://datasheet.ciiva.com/11808/0900766b8106beab-11808595.pdf?src-supplier=RSComponents; ComponentLink2URL: https://datasheet.ciiva.com/2457/pyu-r-int-thick-7-2457158.pdf?src-supplier=Digi-Key; ComponentLink2Description: https://datasheet.ciiva.com/2457/pyu-r-int-thick-7-2457158.pdf?src-supplier=Digi-Key; ComponentLink3URL: https://datasheet.ciiva.com/2457/pyu-r-int-thick-7-2457159.pdf?src-supplier=Digi-Key; ComponentLink3Description: https://datasheet.ciiva.com/2457/pyu-r-int-thick-7-2457159.pdf?src-supplier=Digi-Key; ComponentLink4URL: https://datasheet.ciiva.com/2457/pyu-r-int-thick-7-2457160.pdf?src-supplier=Digi-Key; ComponentLink4Description: https://datasheet.ciiva.com/2457/pyu-r-int-thick-7-2457160.pdf?src-supplier=Digi-Key; ComponentLink5URL: https://datasheet.ciiva.com/16746/rc0805-16746411.pdf?src-supplier=Future+Electronics; ComponentLink5Description: https://datasheet.ciiva.com/16746/rc0805-16746411.pdf?src-supplier=Future+Electronics; ComponentLink6URL: https://datasheet.ciiva.com/15189/getdatasheetpartid-329342-15189900.pdf?src-supplier=Verical; ComponentLink6Description: https://datasheet.ciiva.com/15189/getdatasheetpartid-329342-15189900.pdf?src-supplier=Verical; Supplier Part Number 1: 603-RC0805FR-0713KL
R21 = R_56k_CRCW080556K0FKEA: SMD Resistor, Thick film 56 kOhm,  ±  1 %, 0805, CRCW080556K0FKEA, Vishay; Resistance: 56kR; Tolerance: 1%; Temperature Coefficient: 100ppm/°C; Power Rating: 125mW; Voltage Rating: 150V; Supplier 1: Farnell; Manufacturer: Vishay; Manufacturer Part Number: CRCW080556K0FKEA; RoHS: Yes; Category: Chip SMD Resistors; Stock 1: 85000; Pricing 1: 5000=0,00580, 25000=0,00510 (EUR); Mount: Surface Mount; Case/Package: 0805; Number of Pins: 2; Case Code (Imperial): 0805; Case Code (Metric): 2012; Contact Plating: Tin; Weight: 0.000194oz; Size Code: 0805; Min Operating Temperature: -55°C; Max Operating Temperature: 155°C; Packaging: Tape and Reel; Resistor Type: Thick Film; Termination: SMD/SMT; Series: CRCW; Number of Terminations: 2; Max Power Dissipation: 125mW; Package Quantity: 10; Voltage Rating (DC): 150V; Features: Automotive AEC-Q200; Construction: Rectangular; Resistance Tolerance: 1%; Technology: THICK FILM; Length: 2mm; Width: 1.25mm; Height: 0.45mm; Depth: 1.25mm; Radiation Hardening: No; RoHS Compliant: Yes; Lead Free: Lead Free; Military Standard: Not; REACH SVHC: Unknown; ComponentLink1URL: https://datasheet.ciiva.com/11809/0900766b80d98b26-11809897.pdf?src-supplier=RSComponents; ComponentLink1Description: https://datasheet.ciiva.com/11809/0900766b80d98b26-11809897.pdf?src-supplier=RSComponents; ComponentLink2URL: https://datasheet.ciiva.com/2467/dcrcwe3-2467461.pdf?src-supplier=Digi-Key; ComponentLink2Description: https://datasheet.ciiva.com/2467/dcrcwe3-2467461.pdf?src-supplier=Digi-Key; ComponentLink3URL: https://datasheet.ciiva.com/7841/1697337-7841685.pdf?src-supplier=Element14; ComponentLink3Description: https://datasheet.ciiva.com/7841/1697337-7841685.pdf?src-supplier=Element14; ComponentLink4URL: https://datasheet.ciiva.com/2467/dcrcwe3-2467462.pdf?src-supplier=Digi-Key; ComponentLink4Description: https://datasheet.ciiva.com/2467/dcrcwe3-2467462.pdf?src-supplier=Digi-Key; ComponentLink5URL: https://datasheet.ciiva.com/15159/getdatasheetpartid-250024-15159094.pdf?src-supplier=Verical; ComponentLink5Description: https://datasheet.ciiva.com/15159/getdatasheetpartid-250024-15159094.pdf?src-supplier=Verical; ComponentLink6URL: https://datasheet.ciiva.com/2467/dcrcwe3-2467463.pdf?src-supplier=Digi-Key; ComponentLink6Description: https://datasheet.ciiva.com/2467/dcrcwe3-2467463.pdf?src-supplier=Digi-Key; ComponentLink7URL: https://datasheet.ciiva.com/16773/70201119-16773849.pdf?src-supplier=Allied+Electronics; ComponentLink7Description: https://datasheet.ciiva.com/16773/70201119-16773849.pdf?src-supplier=Allied+Electronics; ComponentLink8URL: https://datasheet.ciiva.com/8999/dcrcwe3-8999098.pdf?src-supplier=Avnet; ComponentLink8Description: https://datasheet.ciiva.com/8999/dcrcwe3-8999098.pdf?src-supplier=Avnet; ComponentLink9URL: https://datasheet.ciiva.com/16435/dcrcwe3-16435882.pdf?src-supplier=Future+Electronics; ComponentLink9Description: https://datasheet.ciiva.com/16435/dcrcwe3-16435882.pdf?src-supplier=Future+Electronics; ComponentLink10URL: https://datasheet.ciiva.com/17176/dcrcwe3-17176426.pdf?src-supplier=Avnet+Europe; ComponentLink10Description: https://datasheet.ciiva.com/17176/dcrcwe3-17176426.pdf?src-supplier=Avnet+Europe; ComponentLink11URL: https://datasheet.ciiva.com/26314/fld-crcw-e3-data-en-26314586.pdf?src-supplier=Distrelec; ComponentLink11Description: https://datasheet.ciiva.com/26314/fld-crcw-e3-data-en-26314586.pdf?src-supplier=Distrelec; ComponentLink12URL: https://datasheet.ciiva.com/48525/dcrcwe3-48525851.pdf?src-supplier=Avnet; ComponentLink12Description: https://datasheet.ciiva.com/48525/dcrcwe3-48525851.pdf?src-supplier=Avnet; Supplier Part Number 1: 2123349
R23 = R_0.022R_WSL2010R0220FEA: Res Metal Strip 2010 0.022 Ohm 1% 1/2W 75ppm/C Molded SMD SMD Embossed Plastic T/R; Manufacturer: Vishay Dale; Resistance: 22mR; Power Rating: 500mW; Temperature Coefficient: 75ppm/°C; Supplier 1: Mouser; Manufacturer Part Number: WSL2010R0220FEA; RoHS: Yes; Category: Chip SMD Resistors; Stock 1: 1942; Mount: Surface Mount; Case/Package: 2010; Case Code (Imperial): 2010; Case Code (Metric): 5025; Contact Plating: Tin,Matte; Min Operating Temperature: -65°C; Max Operating Temperature: 170°C; Resistor Type: Metal Strip; Tolerance: 1%; Packaging: Tape and Reel; Package Quantity: 4000; Termination: SMD/SMT; Length: 5mm; Width: 2.5mm; Height: 0.635mm; Depth: 2.54mm; Radiation Hardening: No; Lead Free: Lead Free; Military Standard: Not; ComponentLink1URL: https://datasheet.ciiva.com/5469/wsl-101914-5469064.pdf?src-supplier=Mouser; ComponentLink1Description: https://datasheet.ciiva.com/5469/wsl-101914-5469064.pdf?src-supplier=Mouser; ComponentLink2URL: https://datasheet.ciiva.com/9028/wsl-9028328.pdf?src-supplier=Avnet; ComponentLink2Description: https://datasheet.ciiva.com/9028/wsl-9028328.pdf?src-supplier=Avnet; Supplier Part Number 1: 71-WSL2010R0220FEA
R24 = R_184k_PTN0805E1843BBT0: Thin Film Resistors - SMD 25ppm 184Kohms .1%; Manufacturer: Vishay Dale; Resistance: 184kR; Power Rating: 200mW; Tolerance: 0.1%; Voltage Rating: 100V; Temperature Coefficient: 25ppm/°C; Supplier 1: Mouser; Manufacturer Part Number: PTN0805E1843BBT0; RoHS: Yes; Category: Chip SMD Resistors; Case/Package: 0805; Case Code (Imperial): 0805; Case Code (Metric): 2012; Contact Plating: Tin,Lead; Min Operating Temperature: -55°C; Max Operating Temperature: 155°C; Termination: SMD/SMT; Packaging: Tape and Reel; Resistor Type: Thin Film; Operating Supply Voltage: 100V; Length: 0.08inch; Width: 0.05inch; Height: 0.033inch; Radiation Hardening: No; Lead Free: Lead Free; ComponentLink1URL: https://datasheet.ciiva.com/8962/ptn-8962989.pdf?src-supplier=Avnet; ComponentLink1Description: https://datasheet.ciiva.com/8962/ptn-8962989.pdf?src-supplier=Avnet; Supplier Part Number 1: 71-PTN0805E1843BBT0
R25 R33 R38 = R_10k_RC0805FR-0710KL: RES SMD 10K OHM 1% 1/8W 0805; Manufacturer: Yageo; Temperature Coefficient: 100ppm/°C; Resistance: 10kR; Power Rating: 125mW; Voltage Rating: 150V; PCBChecked: initials after Checked; Supplier 1: Digi-Key; Manufacturer Part Number: RC0805FR-0710KL; RoHS: Yes; Category: Chip SMD Resistors; Case/Package: 0805; Case Code (Imperial): 0805; Case Code (Metric): 2012; Min Operating Temperature: -55°C; Max Operating Temperature: 155°C; Packaging: Tape and Reel; Tolerance: 1%; Composition: Thick Film; Features: Moisture Resistant; Termination: SMD/SMT; Number of Terminations: 2; Military Standard: Not; Max Power Dissipation: 125mW; Package Quantity: 1; Length: 2mm; Height: 0.024inch; Width: 0.049inch; Depth: 1.25mm; Lead Free: Lead Free; REACH SVHC: Unknown; ComponentLink1URL: https://datasheet.ciiva.com/11808/0900766b8106beab-11808151.pdf?src-supplier=RSComponents; ComponentLink1Description: https://datasheet.ciiva.com/11808/0900766b8106beab-11808151.pdf?src-supplier=RSComponents; ComponentLink2URL: https://datasheet.ciiva.com/12669/rc0805-12669688.pdf?src-supplier=Mouser; ComponentLink2Description: https://datasheet.ciiva.com/12669/rc0805-12669688.pdf?src-supplier=Mouser; ComponentLink3URL: https://datasheet.ciiva.com/2456/pyu-r-int-thick-7-2456973.pdf?src-supplier=Digi-Key; ComponentLink3Description: https://datasheet.ciiva.com/2456/pyu-r-int-thick-7-2456973.pdf?src-supplier=Digi-Key; ComponentLink4URL: https://datasheet.ciiva.com/16747/rc0805-16747087.pdf?src-supplier=Future+Electronics; ComponentLink4Description: https://datasheet.ciiva.com/16747/rc0805-16747087.pdf?src-supplier=Future+Electronics; ComponentLink5URL: https://datasheet.ciiva.com/46447/444164-46447563.pdf?src-supplier=Element14; ComponentLink5Description: https://datasheet.ciiva.com/46447/444164-46447563.pdf?src-supplier=Element14; ComponentLink6URL: https://datasheet.ciiva.com/2456/pyu-r-int-thick-7-2456972.pdf?src-supplier=Digi-Key; ComponentLink6Description: https://datasheet.ciiva.com/2456/pyu-r-int-thick-7-2456972.pdf?src-supplier=Digi-Key; ComponentLink7URL: https://datasheet.ciiva.com/2456/pyu-r-int-thick-7-2456974.pdf?src-supplier=Digi-Key; ComponentLink7Description: https://datasheet.ciiva.com/2456/pyu-r-int-thick-7-2456974.pdf?src-supplier=Digi-Key; Supplier Part Number 1: 311-10.0KCRCT-ND; Stock 1: 31284302; IPC7352C: done; SCHChecked: Initials after checked
R26-R31 = R_0R_RMCF0805ZT0R00: STACKPOLE ELECTRONICS - RMCF0805ZT0R00. - RES THKFLM 0805 0 OHM JUMPER 1/8W 200PPM/ C SMD ROHS COMPLIANT: YES; Resistance: 0mR; Power Rating: 125mW; PCBChecked: initials after Checked; Supplier 1: Digi-Key; Manufacturer Part Number: RMCF0805ZT0R00; RoHS: Yes; Category: Chip SMD Resistors; Mount: Surface Mount; Case/Package: 0805; Case Code (Metric): 2012; Case Code (Imperial): 0805; Contact Plating: Tin,Matte; Min Operating Temperature: -55°C; Max Operating Temperature: 155°C; Packaging: Tape and Reel; Features: Automotive AEC-Q200; Composition: Thick Film; Number of Terminations: 2; Military Standard: Not; Max Power Dissipation: 125mW; Length: 2mm; Height: 0.026inch; Width: 0.049inch; Depth: 1.25mm; Radiation Hardening: No; Lead Free: Lead Free; ComponentLink1URL: https://datasheet.ciiva.com/15193/getdatasheetpartid-360417-15193658.pdf?src-supplier=Verical; ComponentLink1Description: https://datasheet.ciiva.com/15193/getdatasheetpartid-360417-15193658.pdf?src-supplier=Verical; Supplier Part Number 1: RMCF0805ZT0R00CT-ND; Manufacturer: Stackpole Electronics; Stock 1: 361289; IPC7352C: done; SCHChecked: Initials after checked
R32 = R_22R_RC0805FR-0722RL: RES SMD 22 OHM 1% 1/8W 0805; Manufacturer: Yageo; Temperature Coefficient: 100ppm/°C; Power Rating: 125mW; Voltage Rating: 150V; PCBChecked: initials after Checked; Supplier 1: Digi-Key; Manufacturer Part Number: RC0805FR-0722RL; RoHS: Yes; Category: Chip SMD Resistors; Case/Package: 0805; Case Code (Metric): 2012; Case Code (Imperial): 0805; Min Operating Temperature: -55°C; Max Operating Temperature: 155°C; Resistance: 22R; Tolerance: 1%; Packaging: Tape and Reel; Composition: Thick Film; Termination: SMD/SMT; Military Standard: Not; Package Quantity: 1; Number of Terminations: 2; Max Power Dissipation: 125mW; Features: Moisture Resistant; Working Voltage: 150V; Length: 0.079inch; Height: 0.024inch; Width: 0.049inch; Depth: 1.25mm; REACH SVHC: Unknown; Lead Free: Lead Free; ComponentLink1URL: https://datasheet.ciiva.com/11819/0900766b8106beab-11819837.pdf?src-supplier=RSComponents; ComponentLink1Description: https://datasheet.ciiva.com/11819/0900766b8106beab-11819837.pdf?src-supplier=RSComponents; ComponentLink2URL: https://datasheet.ciiva.com/2457/pyu-r-int-thick-7-2457045.pdf?src-supplier=Digi-Key; ComponentLink2Description: https://datasheet.ciiva.com/2457/pyu-r-int-thick-7-2457045.pdf?src-supplier=Digi-Key; ComponentLink3URL: https://datasheet.ciiva.com/2457/pyu-r-int-thick-7-2457046.pdf?src-supplier=Digi-Key; ComponentLink3Description: https://datasheet.ciiva.com/2457/pyu-r-int-thick-7-2457046.pdf?src-supplier=Digi-Key; ComponentLink4URL: https://datasheet.ciiva.com/12667/rc0805-12667371.pdf?src-supplier=Mouser; ComponentLink4Description: https://datasheet.ciiva.com/12667/rc0805-12667371.pdf?src-supplier=Mouser; ComponentLink5URL: https://datasheet.ciiva.com/2457/pyu-r-int-thick-7-2457044.pdf?src-supplier=Digi-Key; ComponentLink5Description: https://datasheet.ciiva.com/2457/pyu-r-int-thick-7-2457044.pdf?src-supplier=Digi-Key; ComponentLink6URL: https://datasheet.ciiva.com/46447/444164-46447574.pdf?src-supplier=Element14; ComponentLink6Description: https://datasheet.ciiva.com/46447/444164-46447574.pdf?src-supplier=Element14; Supplier Part Number 1: 311-22.0CRCT-ND; Stock 1: 302752; IPC7352C: done; SCHChecked: Initials after checked
R34 R49 = R_6.2k_RC0805FR-076K2L: Res Thick Film 0805 6.2K Ohm 1% 0.125W(1/8W) ±100ppm/C Epoxy Pad SMD T/R; Manufacturer: Yageo Phycomp; Voltage Rating (DC): 150V; Resistance: 6.2kR; Temperature Coefficient: 100ppm/°C; Power Rating: 125mW; Supplier 1: Digi-Key; Manufacturer Part Number: RC0805FR-076K2L; RoHS: Yes; Category: Chip SMD Resistors; Stock 1: 164024; Pricing 1: 1=0,10000, 10=0,04000, 100=0,01630, 1000=0,00731, 2500=0,00635 (USD); Mount: Surface Mount; Case/Package: 0805; Min Operating Temperature: -55°C; Max Operating Temperature: 155°C; Packaging: Tape and Reel; Tolerance: 1%; Length: 2mm; Height: 0.5mm; Width: 1.25mm; Depth: 1.25mm; Lead Free: Lead Free; ComponentLink1URL: http://www.yageo.com/documents/recent/PYu-RC_Group_51_RoHS_L_9.pdf?src-supplier=Digi-Key; ComponentLink1Description: http://www.yageo.com/documents/recent/PYu-RC_Group_51_RoHS_L_9.pdf?src-supplier=Digi-Key; Supplier Part Number 1: 311-6.20KCRCT-ND
R35 R36 = R_100k_RC0805FR-07100KL: RES SMD 100K OHM 1% 1/8W 0805; Manufacturer: Yageo; Resistance: 100kR; Temperature Coefficient: 100ppm/°C; Power Rating: 125mW; Voltage Rating (DC): 150V; PCBChecked: initials after Checked; Supplier 1: Digi-Key; Manufacturer Part Number: RC0805FR-07100KL; RoHS: Yes; Category: Chip SMD Resistors; Case/Package: 0805; Number of Pins: 2; Case Code (Metric): 2012; Case Code (Imperial): 0805; Min Operating Temperature: -55°C; Max Operating Temperature: 155°C; Tolerance: 1%; Packaging: Tape and Reel; Composition: Thick Film; Voltage Rating: 150V; Package Quantity: 1; Number of Terminations: 2; Termination: SMD/SMT; Military Standard: Not; Max Power Dissipation: 125mW; Features: Moisture Resistant; Length: 2mm; Height: 0.024inch; Width: 0.049inch; Depth: 1.25mm; Lead Pitch: 0.4mm; REACH SVHC: Unknown; Lead Free: Lead Free; ComponentLink1URL: https://datasheet.ciiva.com/11808/0900766b8106beab-11808858.pdf?src-supplier=RSComponents; ComponentLink1Description: https://datasheet.ciiva.com/11808/0900766b8106beab-11808858.pdf?src-supplier=RSComponents; ComponentLink2URL: https://datasheet.ciiva.com/2457/pyu-r-int-thick-7-2457017.pdf?src-supplier=Digi-Key; ComponentLink2Description: https://datasheet.ciiva.com/2457/pyu-r-int-thick-7-2457017.pdf?src-supplier=Digi-Key; ComponentLink3URL: https://datasheet.ciiva.com/12667/rc0805-12667001.pdf?src-supplier=Mouser; ComponentLink3Description: https://datasheet.ciiva.com/12667/rc0805-12667001.pdf?src-supplier=Mouser; ComponentLink4URL: https://datasheet.ciiva.com/2457/pyu-r-int-thick-7-2457018.pdf?src-supplier=Digi-Key; ComponentLink4Description: https://datasheet.ciiva.com/2457/pyu-r-int-thick-7-2457018.pdf?src-supplier=Digi-Key; ComponentLink5URL: https://datasheet.ciiva.com/16747/rc0805-16747226.pdf?src-supplier=Future+Electronics; ComponentLink5Description: https://datasheet.ciiva.com/16747/rc0805-16747226.pdf?src-supplier=Future+Electronics; ComponentLink6URL: https://datasheet.ciiva.com/2457/pyu-r-int-thick-7-2457019.pdf?src-supplier=Digi-Key; ComponentLink6Description: https://datasheet.ciiva.com/2457/pyu-r-int-thick-7-2457019.pdf?src-supplier=Digi-Key; ComponentLink7URL: https://datasheet.ciiva.com/7660/38627-7660796.pdf?src-supplier=Element14; ComponentLink7Description: https://datasheet.ciiva.com/7660/38627-7660796.pdf?src-supplier=Element14; ComponentLink8URL: https://datasheet.ciiva.com/7941/1697719-7941676.pdf?src-supplier=Element14; ComponentLink8Description: https://datasheet.ciiva.com/7941/1697719-7941676.pdf?src-supplier=Element14; ComponentLink9URL: https://datasheet.ciiva.com/7941/1686128-7941677.pdf?src-supplier=Element14; ComponentLink9Description: https://datasheet.ciiva.com/7941/1686128-7941677.pdf?src-supplier=Element14; ComponentLink10URL: https://datasheet.ciiva.com/7941/1697719-7941678.pdf?src-supplier=Element14; ComponentLink10Description: https://datasheet.ciiva.com/7941/1697719-7941678.pdf?src-supplier=Element14; ComponentLink11URL: https://datasheet.ciiva.com/22747/444164-22747534.pdf?src-supplier=Element14; ComponentLink11Description: https://datasheet.ciiva.com/22747/444164-22747534.pdf?src-supplier=Element14; Supplier Part Number 1: 311-100KCRCT-ND; Stock 1: 6543127; IPC7352C: done; SCHChecked: Initials after checked